# EAGLE design M8340X (EAGLE 6.6.0)
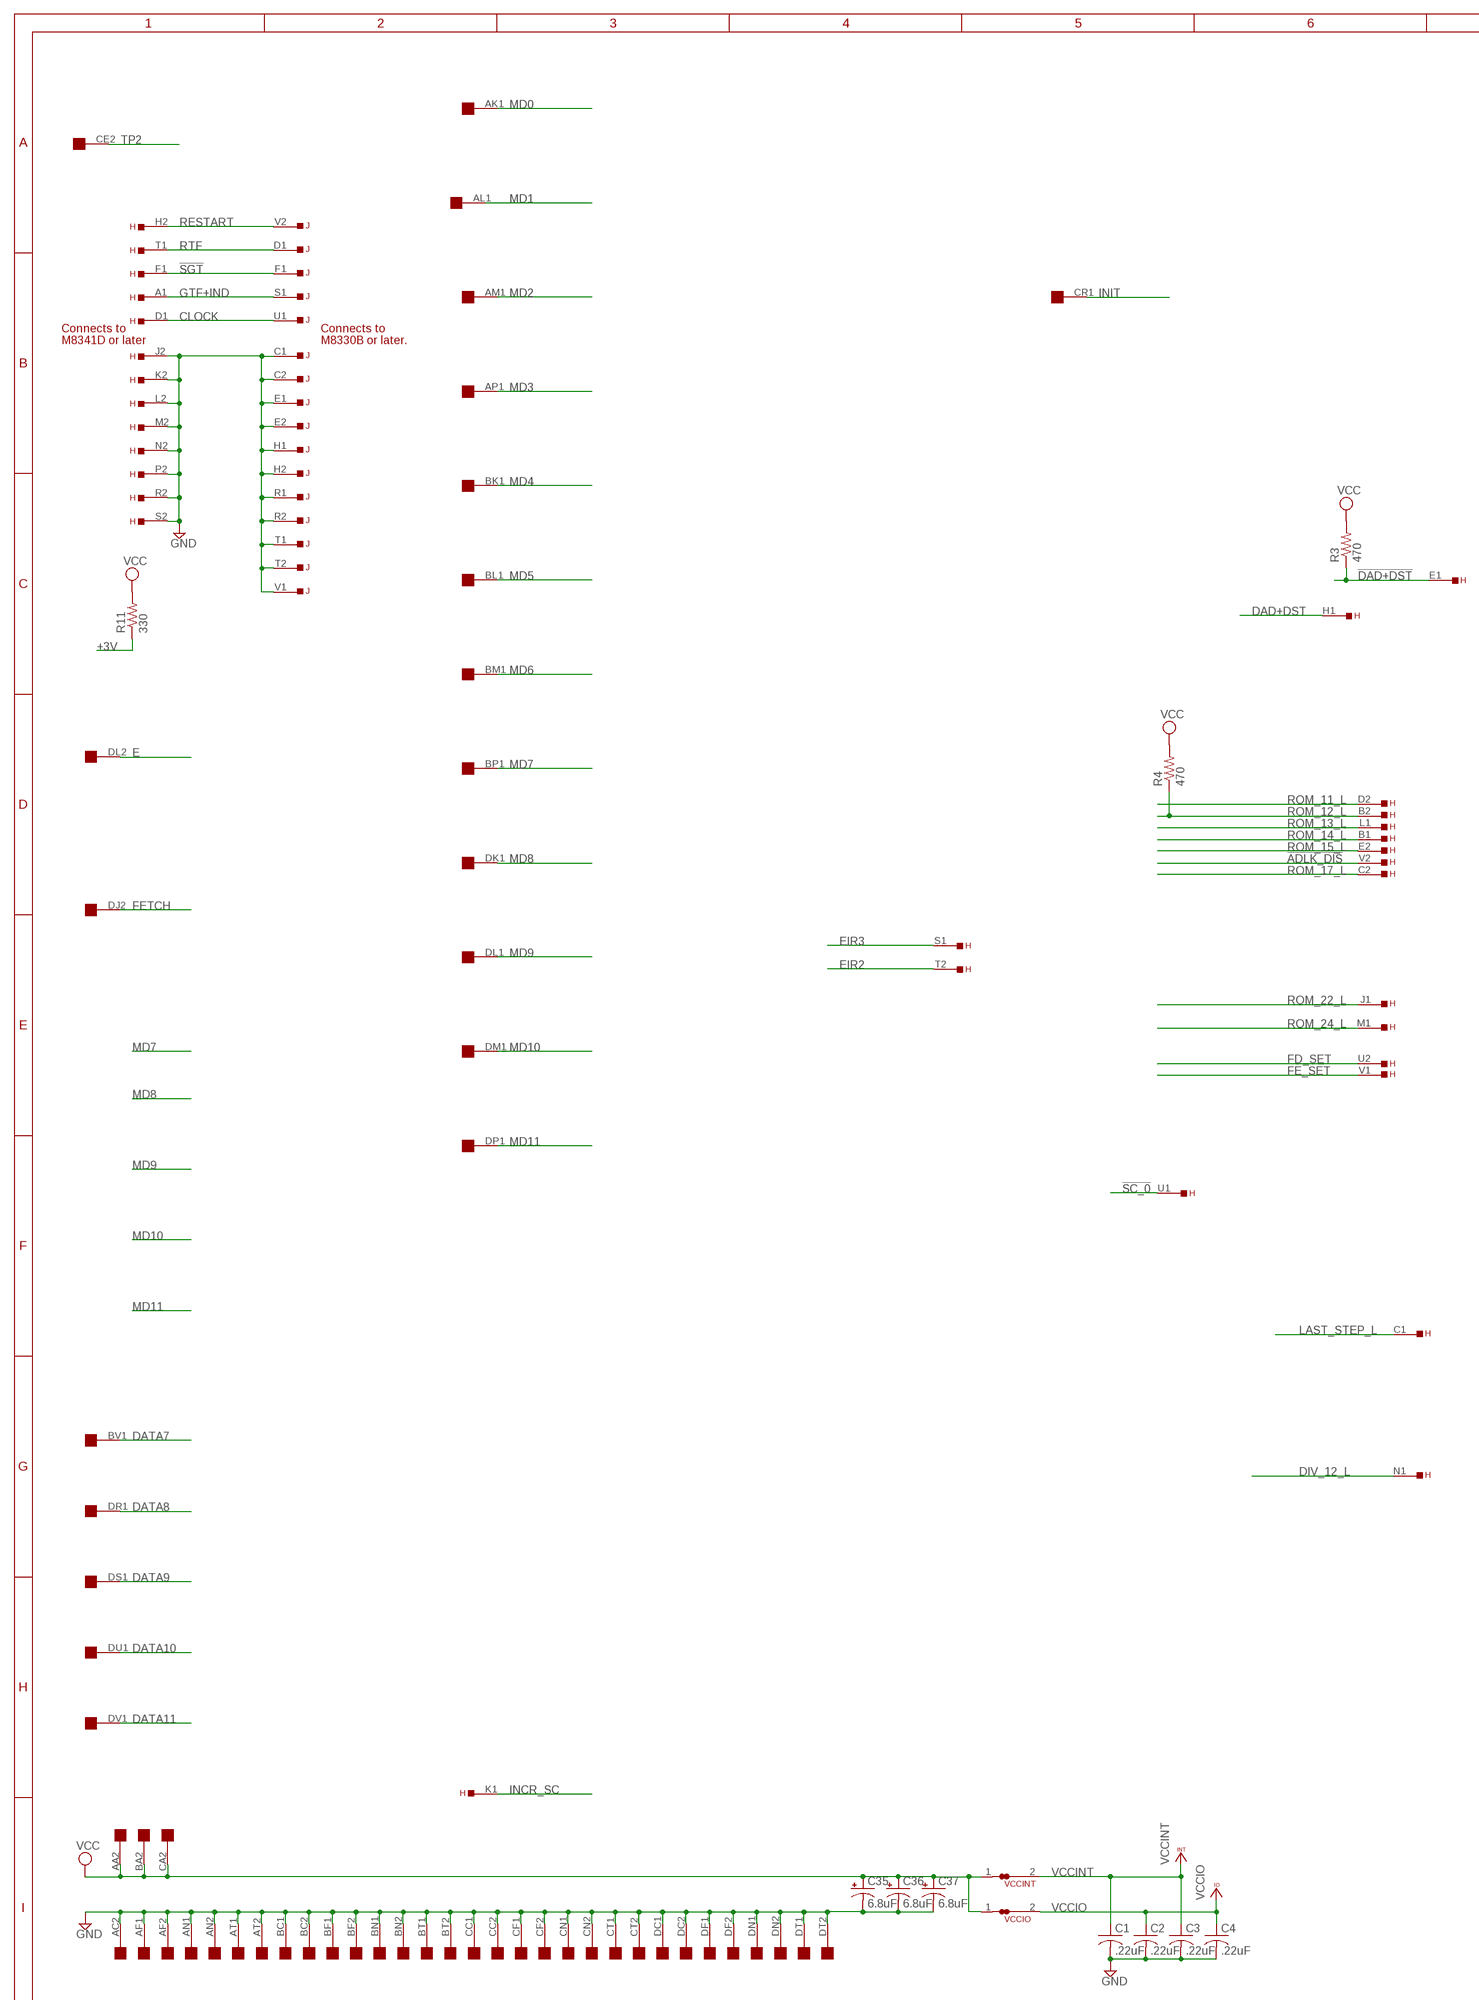
[diagram p0: schematic, sheet 1, part 1 of 2]
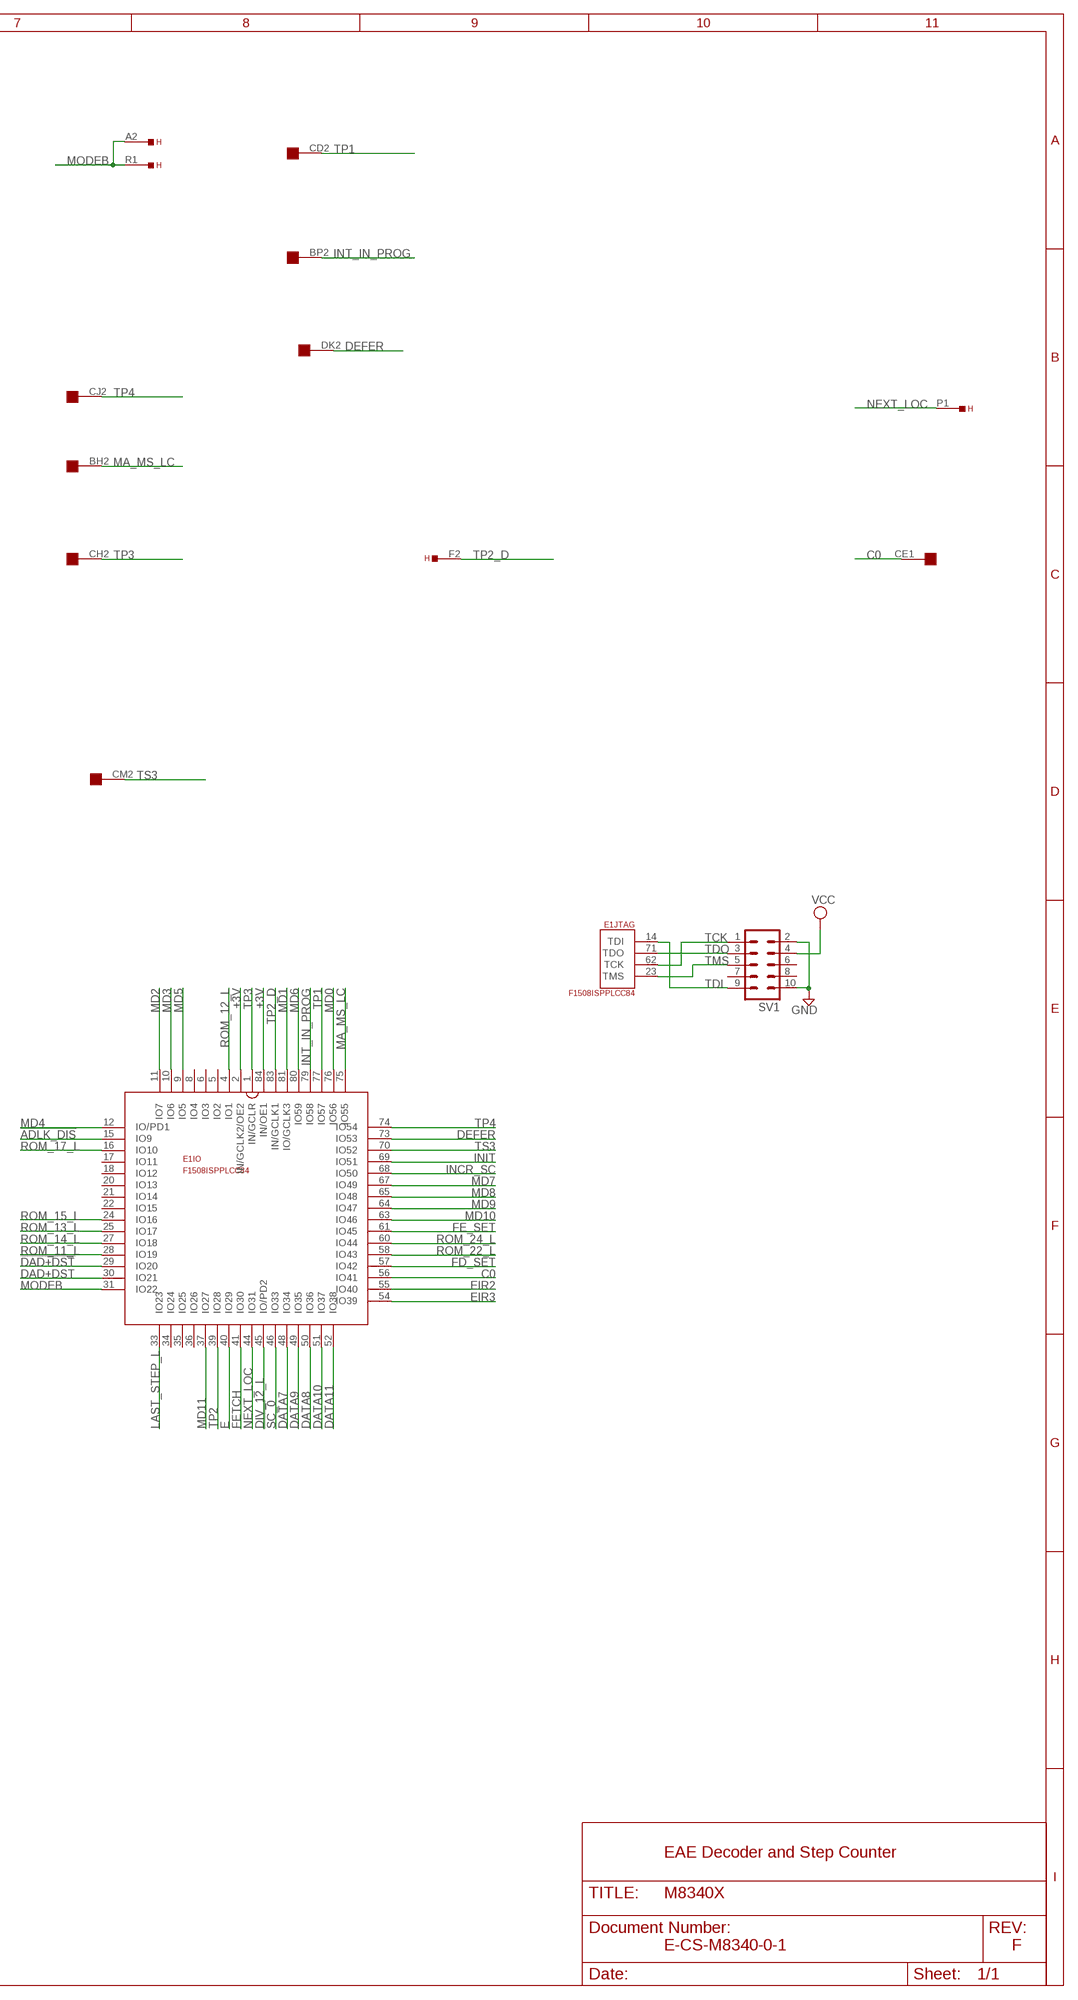
[diagram p1: schematic, sheet 1, part 2 of 2]

## Parts
C1  .22uF  C-US  [C063-025X075]
C2  .22uF  C-US  [C063-025X075]
C3  .22uF  C-US  [C063-025X075]
C4  .22uF  C-US  [C063-025X075]
C35  6.8uF  CPOL-USE20-8AXIAL  [E12-8]
C36  6.8uF  CPOL-USE20-8AXIAL  [E12-8]
C37  6.8uF  CPOL-USE20-8AXIAL  [E12-8]
E1  F1508ISPPLCC84  ATF150X84  [S84]
H  EDGE-TOP  [EDGE-CON2]
J  EDGE-TOP  [EDGE-CON2]
R3  470  R-US_0207/10  [0207/10]
R4  470  R-US_0207/10  [0207/10]
R11  330  R-US_0207/10  [0207/10]
SV1  ML10  [ML10]
U$2  QUAD  [EDGE-CON8]
VCCINT  JUMPER-NC1  [NC1]
VCCIO  JUMPER-NC1  [NC1]

## Nets
!ADLK_DIS: E1.15(IO:IO9) H.V2
!DAD+DST: E1.29(IO:IO20) H.E1 R3.1
!SC_0: E1.46(IO:IO33) H.U1
!SGT: H.F1 J.F1
+3V: E1.2(IO:IN/GCLK2/OE2) E1.84(IO:IN/OE1) R11.1
C0: E1.56(IO:IO41) U$2.CE1
CLOCK: H.D1 J.U1
DAD+DST: E1.30(IO:IO21) H.H1
DATA7: E1.48(IO:IO34) U$2.BV1
DATA8: E1.50(IO:IO36) U$2.DR1
DATA9: E1.49(IO:IO35) U$2.DS1
DATA10: E1.51(IO:IO37) U$2.DU1
DATA11: E1.52(IO:IO38) U$2.DV1
DEFER: E1.73(IO:IO53) U$2.DK2
DIV_12_L: E1.45(IO:IO/PD2) H.N1
E: E1.40(IO:IO29) U$2.DL2
EIR2: E1.55(IO:IO40) H.T2
EIR3: E1.54(IO:IO39) H.S1
FD_SET: E1.57(IO:IO42) H.U2
FE_SET: E1.61(IO:IO45) H.V1
FETCH: E1.41(IO:IO30) U$2.DJ2
GND [supply]: C1.2 C2.2 C3.2 C4.2 C35.- C36.- C37.- H.J2 H.K2 H.L2 H.M2 H.N2 H.P2 H.R2 H.S2 J.C1 J.C2 J.E1 J.E2 J.H1 J.H2 J.R1 J.R2 J.T1 J.T2 J.V1 SV1.2 SV1.10 U$2.AC2 U$2.AF1 U$2.AF2 U$2.AN1 U$2.AN2 U$2.AT1 U$2.AT2 U$2.BC1 U$2.BC2 U$2.BF1 U$2.BF2 U$2.BN1 U$2.BN2 U$2.BT1 U$2.BT2 U$2.CC1 U$2.CC2 U$2.CF1 U$2.CF2 U$2.CN1 U$2.CN2 U$2.CT1 U$2.CT2 U$2.DC1 U$2.DC2 U$2.DF1 U$2.DF2 U$2.DN1 U$2.DN2 U$2.DT1 U$2.DT2
GTF+IND: H.A1 J.S1
INCR_SC: E1.68(IO:IO50) H.K1
INIT: E1.69(IO:IO51) U$2.CR1
INT_IN_PROG: E1.79(IO:IO58) U$2.BP2
LAST_STEP_L: E1.33(IO:IO23) H.C1
MA_MS_LC: E1.75(IO:IO55) U$2.BH2
MD0: E1.76(IO:IO56) U$2.AK1
MD1: E1.81(IO:IO/GCLK3) U$2.AL1
MD2: E1.11(IO:IO7) U$2.AM1
MD3: E1.10(IO:IO6) U$2.AP1
MD4: E1.12(IO:IO/PD1) U$2.BK1
MD5: E1.9(IO:IO5) U$2.BL1
MD6: E1.80(IO:IO59) U$2.BM1
MD7: E1.67(IO:IO49) U$2.BP1
MD8: E1.65(IO:IO48) U$2.DK1
MD9: E1.64(IO:IO47) U$2.DL1
MD10: E1.63(IO:IO46) U$2.DM1
MD11: E1.37(IO:IO27) U$2.DP1
MODEB: E1.31(IO:IO22) H.A2 H.R1
NEXT_LOC: E1.44(IO:IO31) H.P1
RESTART: H.H2 J.V2
ROM_11_L: E1.28(IO:IO19) H.D2
ROM_12_L: E1.4(IO:IO1) H.B2 R4.1
ROM_13_L: E1.25(IO:IO17) H.L1
ROM_14_L: E1.27(IO:IO18) H.B1
ROM_15_L: E1.24(IO:IO16) H.E2
ROM_17_L: E1.16(IO:IO10) H.C2
ROM_22_L: E1.58(IO:IO43) H.J1
ROM_24_L: E1.60(IO:IO44) H.M1
RTF: H.T1 J.D1
TCK: E1.62(JTAG:TCK) SV1.1
TDI: E1.14(JTAG:TDI) SV1.9
TDO: E1.71(JTAG:TDO) SV1.3
TMS: E1.23(JTAG:TMS) SV1.5
TP1: E1.77(IO:IO57) U$2.CD2
TP2: E1.39(IO:IO28) U$2.CE2
TP2_D: E1.83(IO:IN/GCLK1) H.F2
TP3: E1.1(IO:IN/GCLR) U$2.CH2
TP4: E1.74(IO:IO54) U$2.CJ2
TS3: E1.70(IO:IO52) U$2.CM2
VCC [supply]: C35.+ C36.+ C37.+ R3.2 R4.2 R11.2 SV1.4 U$2.AA2 U$2.BA2 U$2.CA2 VCCINT.1 VCCIO.1
VCCINT: C1.1 C3.1 VCCINT.2
VCCIO: C2.1 C4.1 VCCIO.2
Unconnected: E1.5(IO:IO2) E1.6(IO:IO3) E1.8(IO:IO4) E1.17(IO:IO11) E1.18(IO:IO12) E1.20(IO:IO13) E1.21(IO:IO14) E1.22(IO:IO15) E1.34(IO:IO24) E1.35(IO:IO25) E1.36(IO:IO26) J.A1 J.A2 J.B1 J.B2 J.D2 J.F2 J.J1 J.J2 J.K1 J.K2 J.L1 J.L2 J.M1 J.M2 J.N1 J.N2 J.P1 J.P2 J.S2 J.U2 SV1.6 SV1.7 SV1.8 U$2.AA1 U$2.AB1 U$2.AB2 U$2.AC1 U$2.AD1 U$2.AD2 U$2.AE1 U$2.AE2 U$2.AH1 U$2.AH2 U$2.AJ1 U$2.AJ2 U$2.AK2 U$2.AL2 U$2.AM2 U$2.AP2 U$2.AR1 U$2.AR2 U$2.AS1 U$2.AS2 U$2.AU1 U$2.AU2 U$2.AV1 U$2.AV2 U$2.BA1 U$2.BB1 U$2.BB2 U$2.BD1 U$2.BD2 U$2.BE1 U$2.BE2 U$2.BH1 U$2.BJ1 U$2.BJ2 U$2.BK2 U$2.BL2 U$2.BM2 U$2.BR1 U$2.BR2 U$2.BS1 U$2.BS2 U$2.BU1 U$2.BU2 U$2.BV2 U$2.CA1 U$2.CB1 U$2.CB2 U$2.CD1 U$2.CH1 U$2.CJ1 U$2.CK1 U$2.CK2 U$2.CL1 U$2.CL2 U$2.CM1 U$2.CP1 U$2.CP2 U$2.CR2 U$2.CS1 U$2.CS2 U$2.CU1 U$2.CU2 U$2.CV1 U$2.CV2 U$2.DA1 U$2.DA2 U$2.DB1 U$2.DB2 U$2.DD1 U$2.DD2 U$2.DE1 U$2.DE2 U$2.DH1 U$2.DH2 U$2.DJ1 U$2.DM2 U$2.DP2 U$2.DR2 U$2.DS2 U$2.DU2 U$2.DV2

## Notes on the sheet
- Connects to | Connects to
- M8341D or later | M8330B or later.
- EAE Decoder and Step Counter
- E-CS-M8340-0-1 | F

## Power pins joined to a net without a drawn wire
GND: E1.7(GND) E1.19(GND) E1.32(GND) E1.42(GND) E1.47(GND) E1.59(GND) E1.72(GND) E1.82(GND)
VCCINT: E1.3(VCCINT) E1.43(VCCINT)
VCCIO: E1.13(VCCIO) E1.26(VCCIO) E1.38(VCCIO) E1.53(VCCIO) E1.66(VCCIO) E1.78(VCCIO)

## Library data of the parts
C1-C4 = dec-con:C-US: Capacitors with funky DEC lead spacing.
C35-C37 = dec-con:CPOL-USE20-8AXIAL: A 0.8 inch electrolytic.
E1 = atmel-cpld:ATF150X84: ATF150x in 84 pin package.
H J = dec-con:EDGE-TOP: Labeled DEC edge connector, suitable for top connector.
R3 R4 R11 = rcl:R-US_: RESISTOR, American symbol
SV1 = con-harting-ml:ML10: HARTING; OC_FARNELL: unknown; OC_NEWARK: unknown
U$2 = dec-con:QUAD: Quad-Height DEC board
VCCINT VCCIO = dec-con:JUMPER: Normally closed SMD Jumper (Generates a DRC error.)

## Net classes
0 default: width 0.61 mm
1 supply: width 0.61 mm

## Board
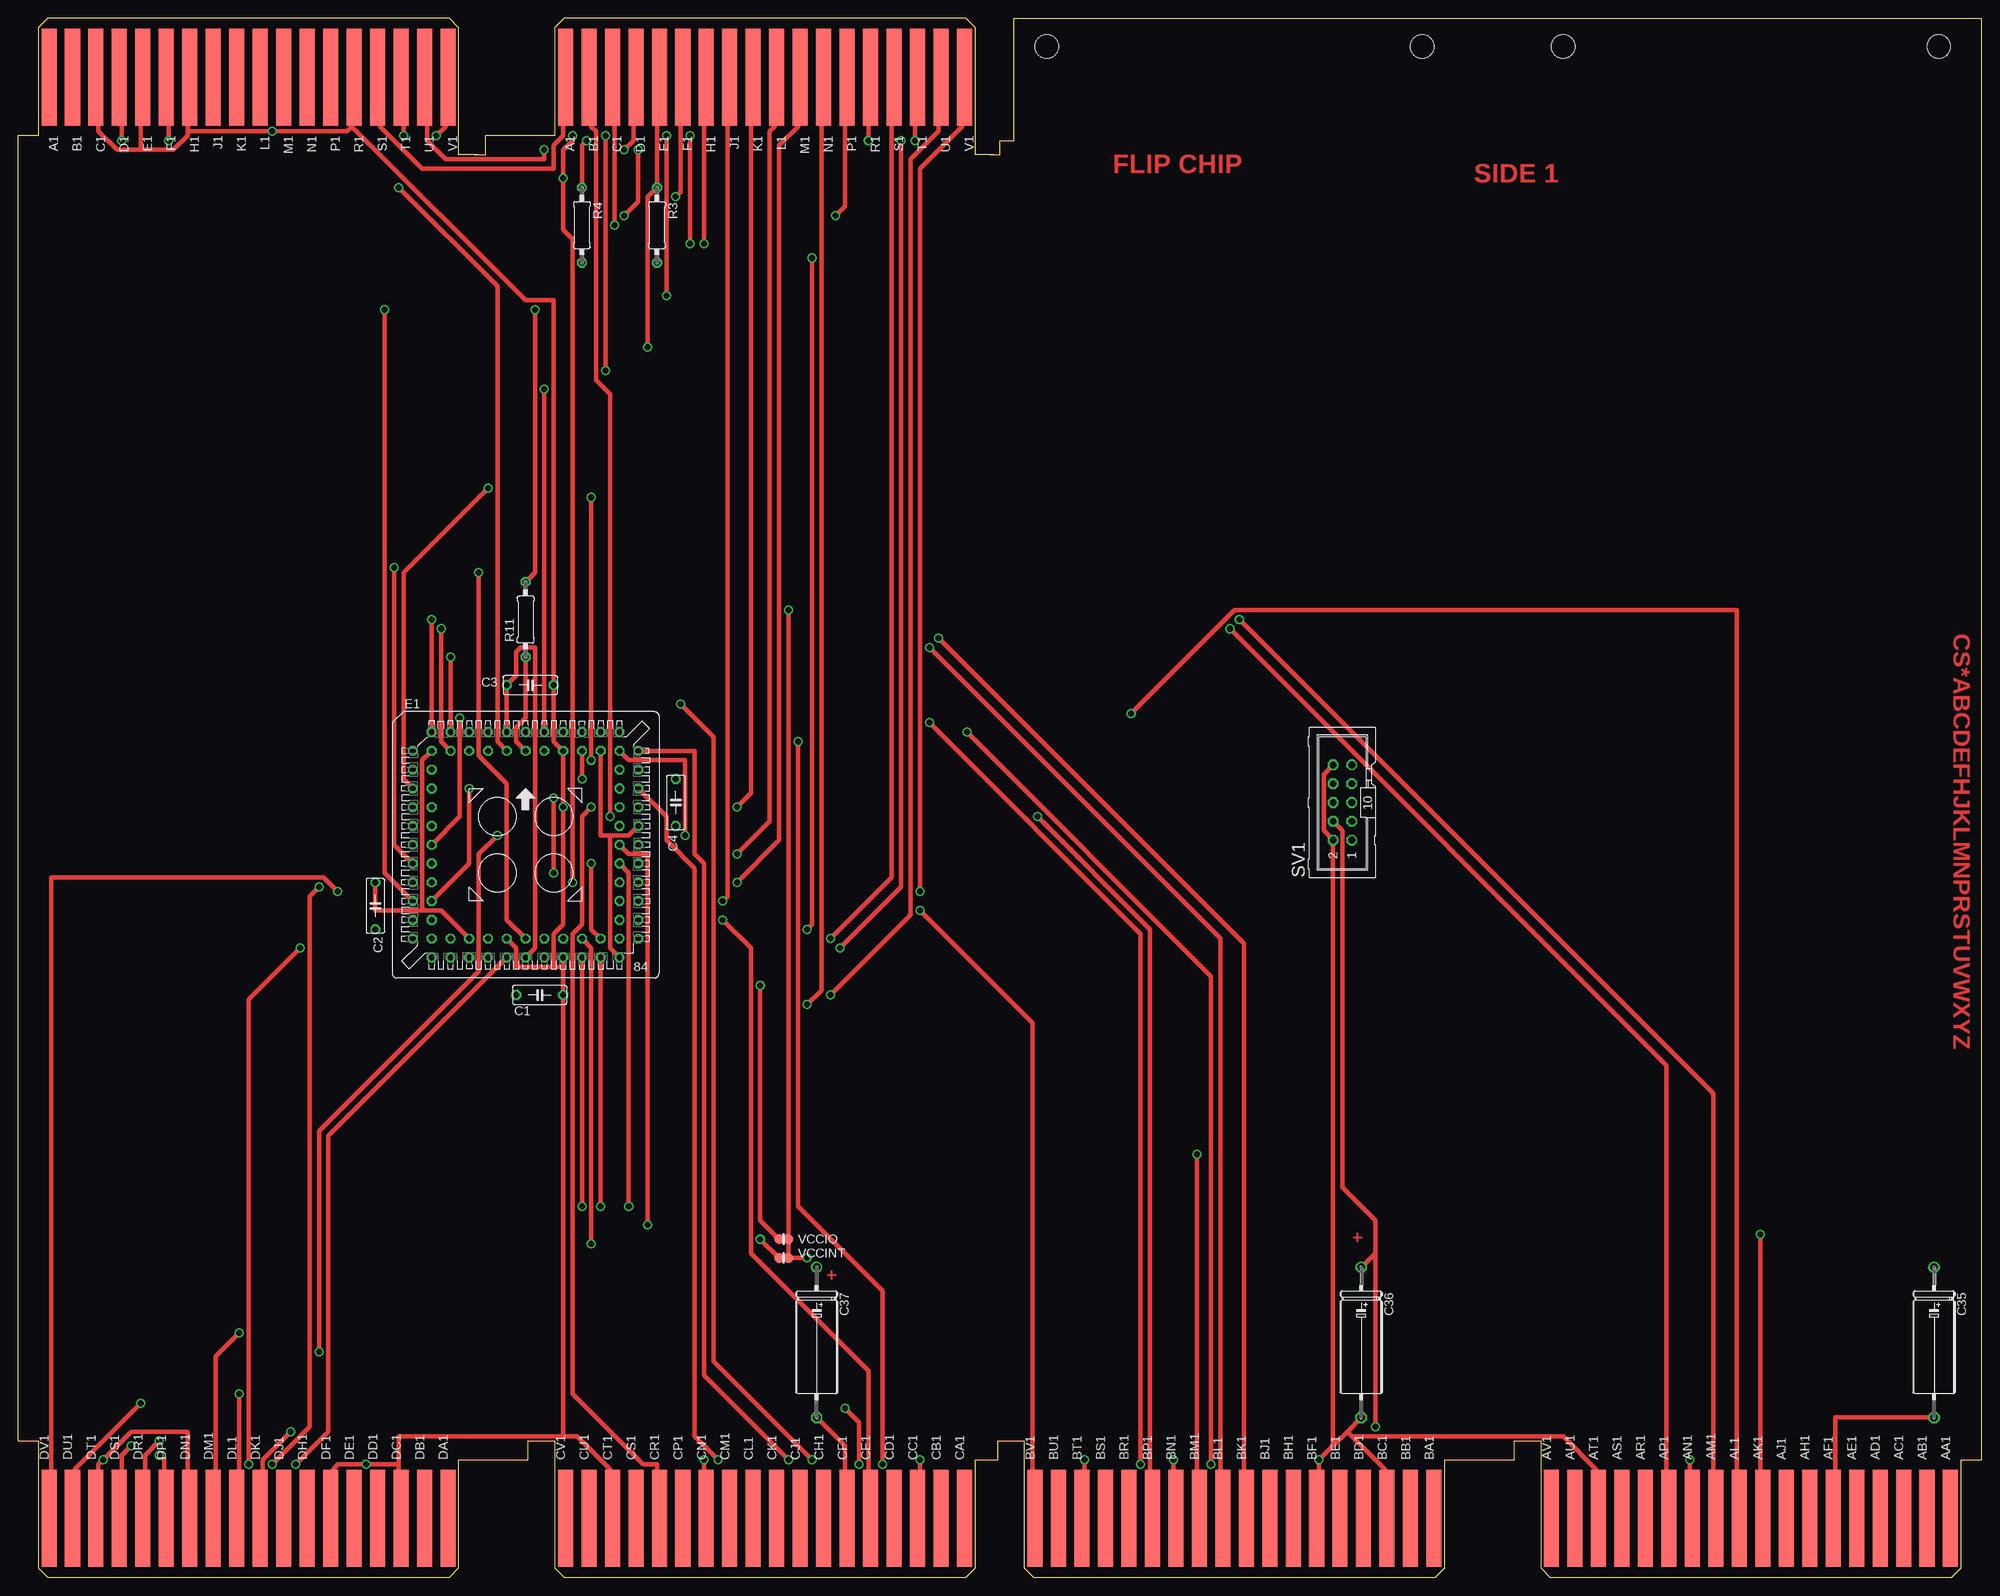
[diagram p2: board, top side]
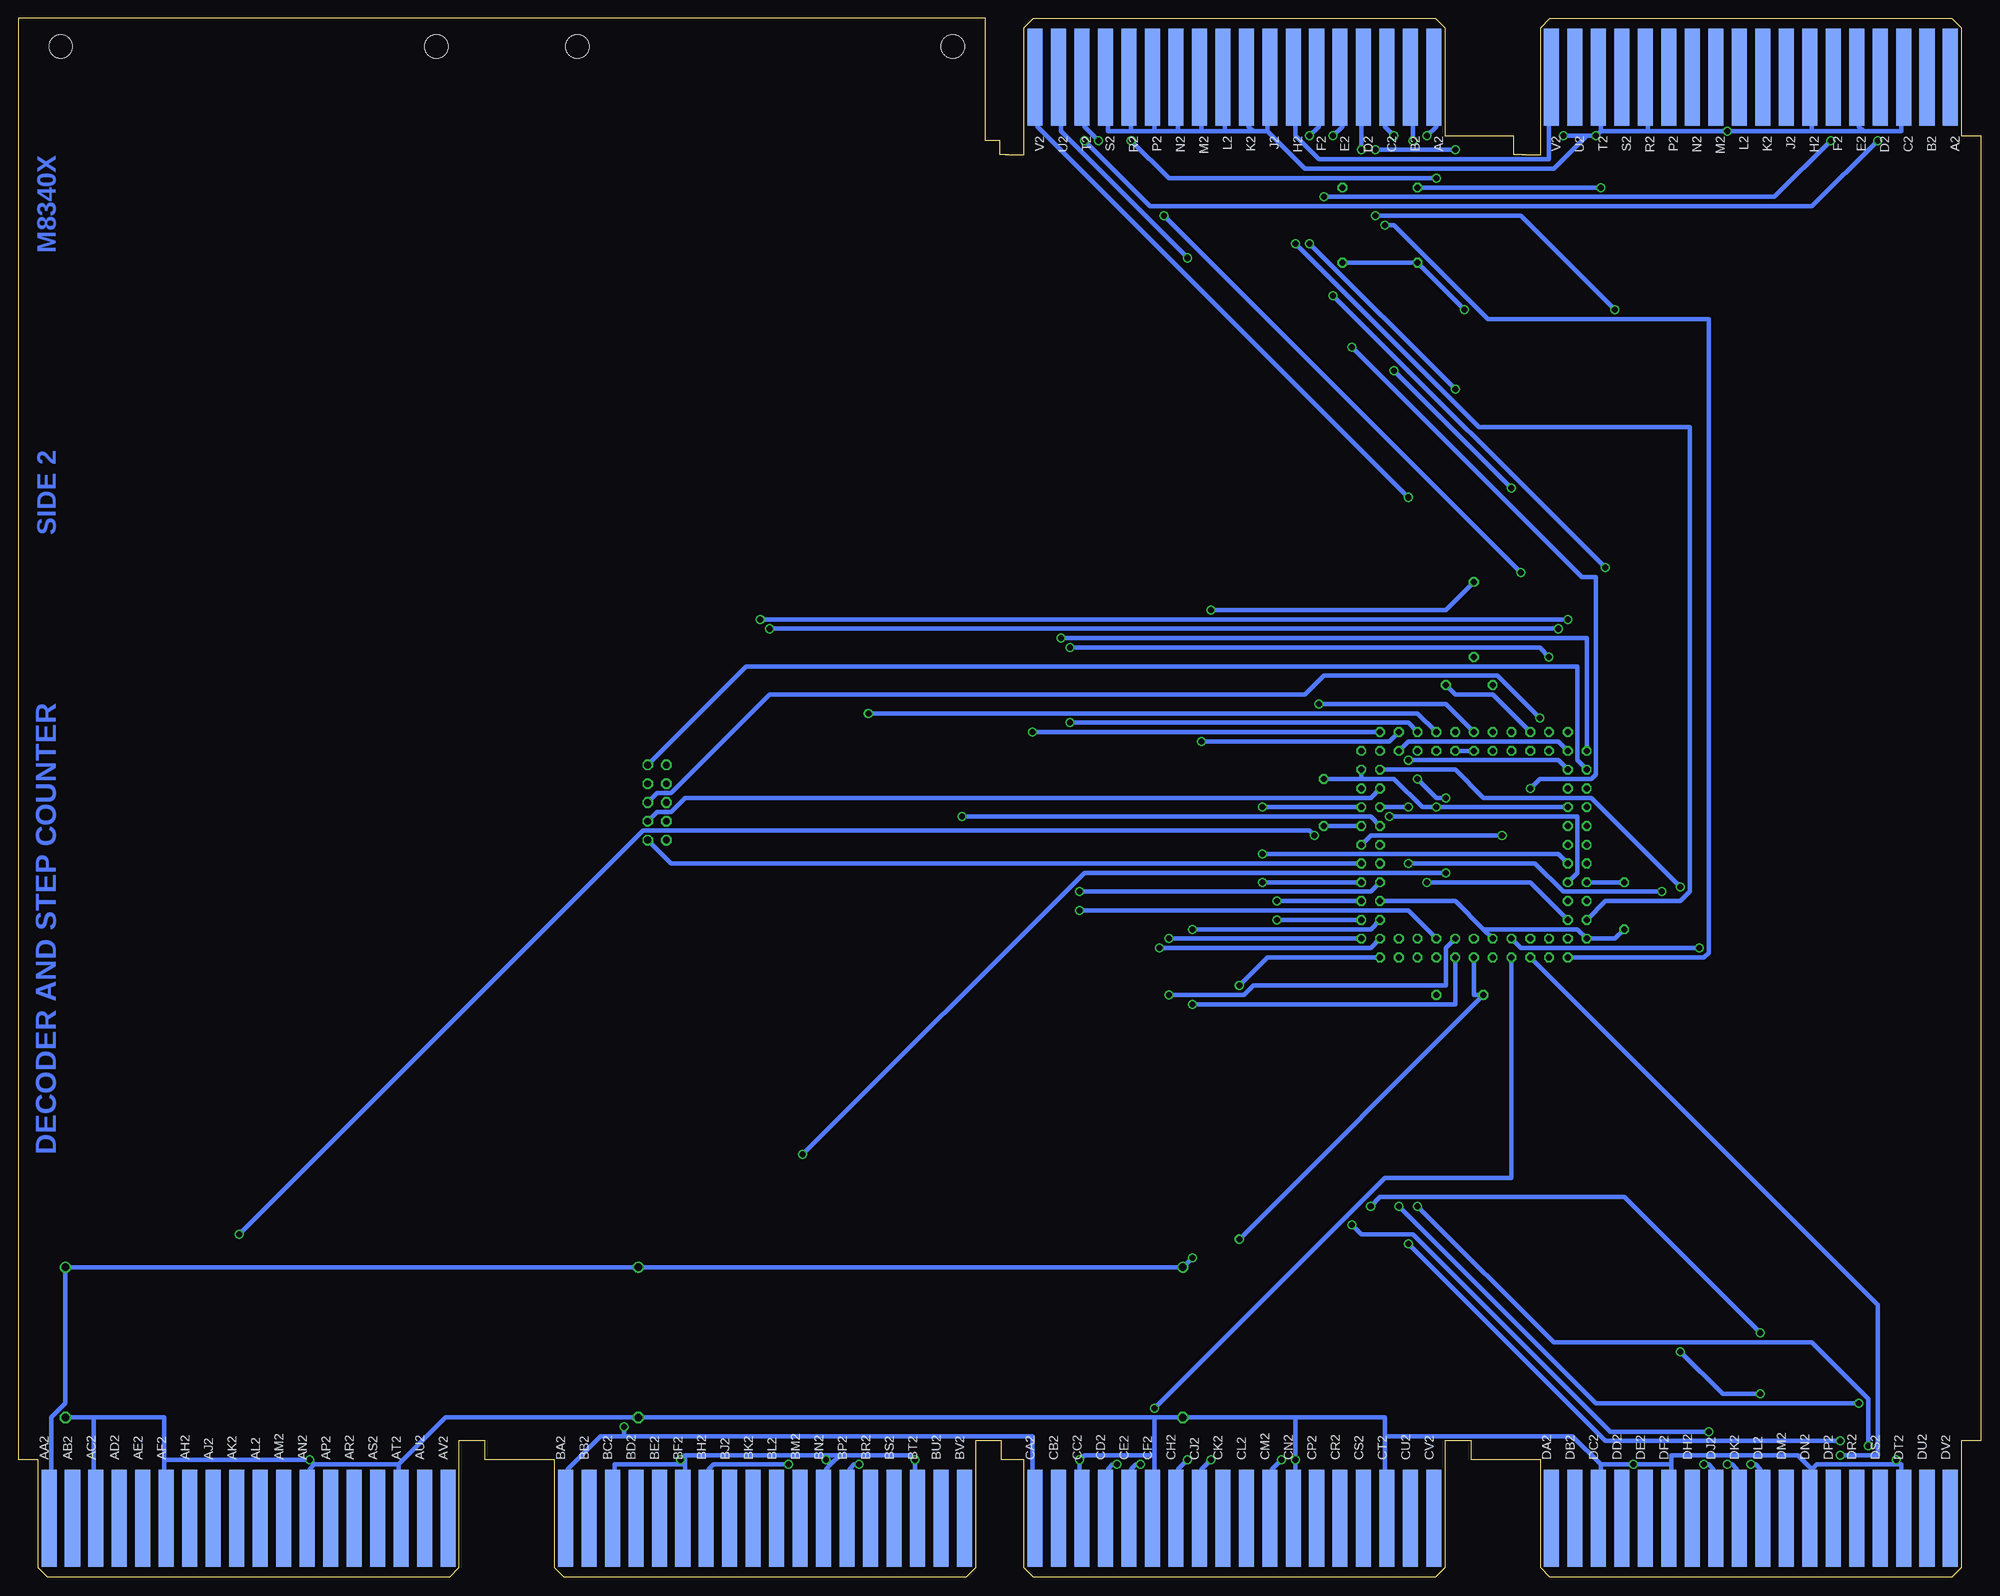
[diagram p3: board, bottom side, seen from below]

Size 265.43 x 210.82 mm. Coordinates in mm from the lower left corner, seen from the top.
Outline: 61.59,192.41 63.18,192.41 63.18,194.94 69.85,194.94
Outline: 131.44,192.41 132.72,192.41 132.72,194.31 134.62,194.31 134.62,210.82 265.43,210.82 265.43,15.88
Outline: 0,194.94 0,18.41 0.64,18.41
Copper layers (1+16): Top 0.035mm / dielectric 1.5mm / Bottom 0.035mm
Design rules "16mils": minimum track width 16mil, minimum drill 32mil, track to track 15mil, track to pad 10mil, pad to pad 10mil, via to via 10mil, smd to smd 10mil, copper to edge 13mil, drill to drill 10mil, minimum pad ring 10mil, minimum via ring 8mil, stop-mask expansion 0mil, vias tented up to drill 0mil, thermal gap 10mil
Holes 3.2 mm at 139.06,207.01 189.87,207.01 208.91,207.01 259.71,207.01

### Footprints (pad centres in the part's own frame; a part is rotated, then mirrored left to right if it is on the bottom)
C063-025X075 = drill 0.813 octagon: 1 -2.54,0; 2 3.81,0
E12-8 = drill 1.016: + -10.16,0 | drill 1.016 octagon: - 10.16,0
S84 = drill 0.813: 1 0,15.24 | drill 0.813 octagon: 2 0,12.7; 3 -2.54,15.24; 4 -2.54,12.7; 5 -5.08,15.24; 6 -5.08,12.7; 7 -7.62,15.24; 8 -7.62,12.7; 9 -10.16,15.24; 10 -10.16,12.7; 11 -12.7,15.24; 12 -15.24,12.7; 13 -12.7,12.7; 14 -15.24,10.16; 15 -12.7,10.16; 16 -15.24,7.62; 17 -12.7,7.62; 18 -15.24,5.08; 19 -12.7,5.08; 20 -15.24,2.54; 21 -12.7,2.54; 22 -15.24,0; 23 -12.7,0; 24 -15.24,-2.54; 25 -12.7,-2.54; 26 -15.24,-5.08; 27 -12.7,-5.08; 28 -15.24,-7.62; 29 -12.7,-7.62; 30 -15.24,-10.16; 31 -12.7,-10.16; 32 -15.24,-12.7; 33 -12.7,-15.24; 34 -12.7,-12.7; 35 -10.16,-15.24; 36 -10.16,-12.7; 37 -7.62,-15.24; 38 -7.62,-12.7; 39 -5.08,-15.24; 40 -5.08,-12.7; 41 -2.54,-15.24; 42 -2.54,-12.7; 43 0,-15.24; 44 0,-12.7; 45 2.54,-15.24; 46 2.54,-12.7; 47 5.08,-15.24; 48 5.08,-12.7; 49 7.62,-15.24; 50 7.62,-12.7; 51 10.16,-15.24; 52 10.16,-12.7; 53 12.7,-15.24; 54 15.24,-12.7; 55 12.7,-12.7; 56 15.24,-10.16; 57 12.7,-10.16; 58 15.24,-7.62; 59 12.7,-7.62; 60 15.24,-5.08; 61 12.7,-5.08; 62 15.24,-2.54; 63 12.7,-2.54; 64 15.24,0; 65 12.7,0; 66 15.24,2.54; 67 12.7,2.54; 68 15.24,5.08; 69 12.7,5.08; 70 15.24,7.62; 71 12.7,7.62; 72 15.24,10.16; 73 12.7,10.16; 74 15.24,12.7; 75 12.7,15.24; 76 12.7,12.7; 77 10.16,15.24; 78 10.16,12.7; 79 7.62,15.24; 80 7.62,12.7; 81 5.08,15.24; 82 5.08,12.7; 83 2.54,15.24; 84 2.54,12.7
EDGE-CON2 = smd 13.106 x 2.032: A1 7.938,4.128; B1 7.938,7.303; C1 7.938,10.477; D1 7.938,13.652; E1 7.938,16.828; F1 7.938,20.003; H1 7.938,23.177; J1 7.938,26.352; K1 7.938,29.527; L1 7.938,32.703; M1 7.938,35.877; N1 7.938,39.053; P1 7.938,42.227; R1 7.938,45.403; S1 7.938,48.578; T1 7.938,51.752; U1 7.938,54.928; V1 7.938,58.102 | smd 13.106 x 2.032 bottom: A2 7.938,4.128; B2 7.938,7.303; C2 7.938,10.477; D2 7.938,13.652; E2 7.938,16.828; F2 7.938,20.003; H2 7.938,23.177; J2 7.938,26.352; K2 7.938,29.527; L2 7.938,32.703; M2 7.938,35.877; N2 7.938,39.053; P2 7.938,42.227; R2 7.938,45.403; S2 7.938,48.578; T2 7.938,51.752; U2 7.938,54.928; V2 7.938,58.102
0207/10 = drill 0.813 octagon: 1 -5.08,0; 2 5.08,0
ML10 = drill 0.914 octagon: 1 -5.08,-1.27; 2 -5.08,1.27; 3 -2.54,-1.27; 4 -2.54,1.27; 5 0,-1.27; 6 0,1.27; 7 2.54,-1.27; 8 2.54,1.27; 9 5.08,-1.27; 10 5.08,1.27
EDGE-CON8 = smd 2.032 x 13.106: AA1 261.303,7.938; AB1 258.127,7.938; AC1 254.952,7.938; AD1 251.778,7.938; AE1 248.602,7.938; AF1 245.428,7.938; AH1 242.252,7.938; AJ1 239.077,7.938; AK1 235.903,7.938; AL1 232.727,7.938; AM1 229.553,7.938; AN1 226.377,7.938; AP1 223.202,7.938; AR1 220.028,7.938; AS1 216.852,7.938; AT1 213.678,7.938; AU1 210.502,7.938; AV1 207.327,7.938; BA1 191.452,7.938; BB1 188.278,7.938; BC1 185.102,7.938; BD1 181.928,7.938; BE1 178.752,7.938; BF1 175.577,7.938; BH1 172.403,7.938; BJ1 169.227,7.938; BK1 166.053,7.938; BL1 162.877,7.938; BM1 159.702,7.938; BN1 156.528,7.938; BP1 153.352,7.938; BR1 150.178,7.938; BS1 147.002,7.938; BT1 143.827,7.938; BU1 140.653,7.938; BV1 137.477,7.938; CA1 127.953,7.938; CB1 124.778,7.938; CC1 121.603,7.938; CD1 118.427,7.938; CE1 115.252,7.938; CF1 112.078,7.938; CH1 108.903,7.938; CJ1 105.728,7.938; CK1 102.552,7.938; CL1 99.377,7.938; CM1 96.203,7.938; CN1 93.028,7.938; CP1 89.853,7.938; CR1 86.677,7.938; CS1 83.502,7.938; CT1 80.328,7.938; CU1 77.153,7.938; CV1 73.978,7.938; DA1 58.102,7.938; DB1 54.928,7.938; DC1 51.752,7.938; DD1 48.578,7.938; DE1 45.403,7.938; DF1 42.227,7.938; DH1 39.053,7.938; DJ1 35.877,7.938; DK1 32.703,7.938; DL1 29.527,7.938; DM1 26.352,7.938; DN1 23.177,7.938; DP1 20.003,7.938; DR1 16.828,7.938; DS1 13.652,7.938; DT1 10.477,7.938; DU1 7.303,7.938; DV1 4.128,7.938 | smd 2.032 x 13.106 bottom: AA2 261.303,7.938; AB2 258.127,7.938; AC2 254.952,7.938; AD2 251.778,7.938; AE2 248.602,7.938; AF2 245.428,7.938; AH2 242.252,7.938; AJ2 239.077,7.938; AK2 235.903,7.938; AL2 232.727,7.938; AM2 229.553,7.938; AN2 226.377,7.938; AP2 223.202,7.938; AR2 220.028,7.938; AS2 216.852,7.938; AT2 213.678,7.938; AU2 210.502,7.938; AV2 207.327,7.938; BA2 191.452,7.938; BB2 188.278,7.938; BC2 185.102,7.938; BD2 181.928,7.938; BE2 178.752,7.938; BF2 175.577,7.938; BH2 172.403,7.938; BJ2 169.227,7.938; BK2 166.053,7.938; BL2 162.877,7.938; BM2 159.702,7.938; BN2 156.528,7.938; BP2 153.352,7.938; BR2 150.178,7.938; BS2 147.002,7.938; BT2 143.827,7.938; BU2 140.653,7.938; BV2 137.477,7.938; CA2 127.953,7.938; CB2 124.778,7.938; CC2 121.603,7.938; CD2 118.427,7.938; CE2 115.252,7.938; CF2 112.078,7.938; CH2 108.903,7.938; CJ2 105.728,7.938; CK2 102.552,7.938; CL2 99.377,7.938; CM2 96.203,7.938; CN2 93.028,7.938; CP2 89.853,7.938; CR2 86.677,7.938; CS2 83.502,7.938; CT2 80.328,7.938; CU2 77.153,7.938; CV2 73.978,7.938; DA2 58.102,7.938; DB2 54.928,7.938; DC2 51.752,7.938; DD2 48.578,7.938; DE2 45.403,7.938; DF2 42.227,7.938; DH2 39.053,7.938; DJ2 35.877,7.938; DK2 32.703,7.938; DL2 29.527,7.938; DM2 26.352,7.938; DN2 23.177,7.938; DP2 20.003,7.938; DR2 16.828,7.938; DS2 13.652,7.938; DT2 10.477,7.938; DU2 7.303,7.938; DV2 4.128,7.938
NC1 = smd 1.346 x 1.346: 1 -0.635,0; 2 0.635,0

### Placement (x,y rotation side)
C1  69.85,78.74 0 top
C2  48.26,91.44 270 top
C3  68.58,120.65 0 top
C4  88.9,104.14 90 top
C35  259.08,31.75 270 top
C36  181.61,31.75 270 top
C37  107.95,31.75 270 top
E1  68.58,99.06 0 top
H  69.85,210.82 270 top
J  0,210.82 270 top
R3  86.36,182.88 270 top
R4  76.2,182.88 270 top
R11  68.58,129.54 90 top
SV1  179.07,104.78 90 top
U$2  0,0 0 top
VCCINT  103.5,43.18 180 top
VCCIO  103.5,45.72 180 top

### Tracks (layer width: path | path; a pad name or v marks a point on that pad's centre or on a via)
!ADLK_DIS  (via drill 0.81)
  Top 0.61: v77.47,146.05 v77.47,110.49
  Bottom 0.61: E1.15 57.15,110.49 v77.47,110.49 | v77.47,146.05 127.64,196.22 127.64,202.56 H.V2
!DAD+DST  (via drill 0.81)
  Top 0.61: E1.29 60.96,96.52 v60.96,106.68 | v85.09,166.37 85.09,186.69 R3.1 86.36,202.56 H.E1
  Bottom 0.61: v60.96,106.68 59.69,107.95 52.7,107.95 52.07,108.58 52.07,135.25 53.98,135.25 v85.09,166.37
!SC_0  (via drill 0.81)
  Top 0.61: v109.86,78.74 120.65,89.53 120.65,191.77 124.46,195.58 124.46,202.56 H.U1
  Bottom 0.61: E1.46 72.39,85.09 72.39,80.01 98.42,80.01 99.69,78.74 v109.86,78.74
!SGT  (via drill 0.81)
  Top 0.61: v20.32,194.31 20.32,202.56 J.F1 | v88.9,186.69 89.53,187.32 89.53,202.56 H.F1
  Bottom 0.61: v20.32,194.31 27.94,186.69 v88.9,186.69
+3V
  Top 0.61: R11.1 68.58,116.2 67.31,114.94 67.31,113.03 E1.2
  Bottom 0.61: E1.84 E1.2
C0  (via drill 0.81)
  Top 0.61: v95.25,88.9 99.06,85.09 99.06,43.81 114.94,27.94 114.94,8.26 U$2.CE1
  Bottom 0.61: v95.25,88.9 E1.56
CLOCK  (via drill 0.81)
  Top 0.61: v71.12,193.04 71.12,191.77 57.78,191.77 55.24,194.31 55.24,202.56 J.U1 | v81.92,193.04 83.19,194.31 83.19,202.56 H.D1
  Bottom 0.61: v81.92,193.04 v71.12,193.04
DAD+DST  (via drill 0.81)
  Top 0.61: v92.71,180.34 92.71,202.56 H.H1
  Bottom 0.61: E1.30 50.8,91.44 40.64,91.44 39.37,92.71 39.37,155.57 67.94,155.57 v92.71,180.34
DATA7  (via drill 0.81)
  Top 0.61: v121.92,90.17 137.16,74.93 137.16,8.26 U$2.BV1
  Bottom 0.61: E1.48 77.47,90.17 v121.92,90.17
DATA8  (via drill 0.81)
  Top 0.61: E1.50 77.47,85.09 v77.47,45.09 | v19.05,18.41 17.14,16.51 17.14,8.26 U$2.DR1
  Bottom 0.61: v77.47,45.09 50.8,18.41 v19.05,18.41
DATA9  (via drill 0.81)
  Top 0.61: v76.2,50.16 E1.49 | v15.24,17.78 13.97,16.51 13.97,8.26 U$2.DS1
  Bottom 0.61: v76.2,50.16 57.78,31.75 22.86,31.75 15.24,24.13 v15.24,17.78
DATA10  (via drill 0.81)
  Top 0.61: v78.74,50.16 E1.51 | v16.51,23.5 7.62,14.61 7.62,8.26 U$2.DU1
  Bottom 0.61: v78.74,50.16 52.07,23.5 v16.51,23.5
DATA11  (via drill 0.81)
  Top 0.61: E1.52 77.47,87.63 v77.47,96.52 | v43.18,92.71 41.27,94.61 4.45,94.61 4.45,8.26 U$2.DV1
  Bottom 0.61: v77.47,96.52 60.33,96.52 56.52,92.71 v43.18,92.71
DEFER  (via drill 0.81)
  Top 0.61: v40.64,93.34 39.37,92.08 39.37,20.32 v34.29,15.24
  Bottom 0.61: E1.73 71.12,109.22 67.31,105.41 52.7,105.41 v40.64,93.34 | v34.29,15.24 33.66,15.24 33.02,14.61 33.02,8.26 U$2.DK2
DIV_12_L  (via drill 0.81)
  Top 0.61: v106.68,77.47 108.58,79.38 108.58,202.56 H.N1
  Bottom 0.61: E1.45 71.12,77.47 v106.68,77.47
E  (via drill 0.81)
  Top 0.61: v38.1,85.09 31.11,78.11 v31.11,15.24
  Bottom 0.61: E1.40 62.23,85.09 v38.1,85.09 | v31.11,15.24 30.48,15.24 29.84,14.61 29.84,8.26 U$2.DL2
EIR2  (via drill 0.81)
  Top 0.61: v111.12,85.09 119.38,93.34 v119.38,194.31
  Bottom 0.61: E1.55 82.55,85.09 v111.12,85.09 | v119.38,194.31 121.28,196.22 121.28,202.56 H.T2
EIR3  (via drill 0.81)
  Top 0.61: v109.86,86.36 118.11,94.61 118.11,202.56 H.S1
  Bottom 0.61: v109.86,86.36 E1.54
FD_SET  (via drill 0.81)
  Top 0.61: v106.68,87.63 107.31,88.27 v107.31,178.44
  Bottom 0.61: E1.57 82.55,87.63 v106.68,87.63 | v107.31,178.44 124.46,195.58 124.46,202.56 H.U2
FE_SET  (via drill 0.81)
  Top 0.61: v121.92,92.71 121.92,190.5 127.64,196.22 127.64,202.56 H.V1
  Bottom 0.61: E1.61 82.55,92.71 v121.92,92.71
FETCH  (via drill 0.81)
  Top 0.61: E1.41 41.91,59.69 41.91,19.68 v37.47,15.24
  Bottom 0.61: v37.47,15.24 36.83,15.24 36.2,14.61 36.2,8.26 U$2.DJ2
GND  (via drill 0.81)
  Top 0.61: v226.06,15.88 226.06,8.26 U$2.AN1 | C35.- 245.75,21.59 245.75,8.26 U$2.AF1 | v144.15,15.88 144.15,8.26 U$2.BT2 | v156.21,15.88 156.21,8.26 U$2.BN2 | SV1.10 176.53,108.58 176.53,100.97 SV1.2 177.8,17.78 | 177.8,17.78 v175.9,15.88 175.9,8.26 U$2.BF2 | 177.8,17.78 179.71,19.68 | 179.71,19.68 C36.- | 179.71,19.68 180.34,19.05 | 180.34,19.05 184.78,14.61 184.78,8.26 U$2.BC2 | 180.34,19.05 208.91,19.05 213.36,14.61 213.36,8.26 U$2.AT1 | 16.51,193.04 13.34,193.04 10.79,195.58 10.79,202.56 J.C2 | 16.51,193.04 16.51,202.56 J.E1 | 22.86,195.58 22.86,194.94 20.95,193.04 16.51,193.04 | 22.86,195.58 22.86,202.56 J.H1 | 45.09,196.22 45.09,202.56 J.R1 | 45.09,196.22 44.45,195.58 v34.29,195.58 22.86,195.58 | v52.07,194.94 52.07,202.56 J.T1 | v56.52,194.94 57.78,196.22 57.78,202.56 J.V1 | E1.47 73.66,82.55 | 73.66,82.55 C1.2 73.66,19.05 | 72.39,82.55 67.31,82.55 67.31,85.09 E1.42 | 72.39,82.55 73.66,82.55 | 72.39,82.55 72.39,87 73.66,88.27 v73.66,104.14 E1.82 72.39,113.03 C3.2 72.39,172.72 68.58,172.72 45.09,196.22 | v121.92,15.88 121.92,8.26 U$2.CC2 | C37.- 111.76,17.78 111.76,8.26 U$2.CF2 | v92.71,15.88 92.71,8.26 U$2.CN2 | 51.44,15.24 v46.99,15.24 43.18,15.24 42.55,14.61 42.55,8.26 U$2.DF2 | 51.44,15.24 51.44,8.26 U$2.DC2 | 73.66,19.05 51.44,19.05 51.44,15.24 | 73.66,19.05 75.56,19.05 80.01,14.61 80.01,8.26 U$2.CT2 | U$2.DT2 10.79,8.26 10.79,15.24 v11.43,15.88 15.24,19.68 22.86,19.68 22.86,8.26 U$2.DN2
  Bottom 0.61: 214,15.24 214,8.26 U$2.AT1 | 225.43,15.24 214,15.24 | 225.43,15.24 226.06,14.61 226.06,8.26 U$2.AN1 | 225.43,15.24 v226.06,15.88 245.75,15.88 | 245.75,15.88 245.75,21.59 255.27,21.59 | 245.75,15.88 245.75,8.26 U$2.AF1 | C35.- 255.27,21.59 | 255.27,21.59 255.27,8.26 U$2.AC2 | U$2.BT2 144.15,8.26 v144.15,15.88 144.78,16.51 154.31,16.51 | 155.57,15.24 156.21,14.61 156.21,8.26 U$2.BN2 | 155.57,15.24 154.31,16.51 | 155.57,15.24 v156.21,15.88 | 175.26,15.88 175.26,16.51 154.31,16.51 | 175.26,15.88 175.26,15.24 | 175.26,15.24 175.26,8.26 U$2.BF2 | 175.26,15.24 184.78,15.24 184.78,8.26 U$2.BC2 | v175.9,15.88 175.26,15.88 | 214,15.24 207.65,21.59 C36.- 111.76,21.59 | 96.52,195.58 96.52,202.56 H.J2 | 98.42,195.58 96.52,195.58 | 98.42,195.58 99.06,196.22 99.06,202.56 H.K2 | 102.23,195.58 102.23,202.56 H.L2 | 98.42,195.58 102.23,195.58 | 105.41,195.58 105.41,202.56 H.M2 | 102.23,195.58 105.41,195.58 | 108.58,195.58 108.58,202.56 H.N2 | 105.41,195.58 108.58,195.58 | 111.76,195.58 111.76,202.56 H.P2 | 108.58,195.58 111.76,195.58 | 114.94,195.58 114.94,202.56 H.R2 | 111.76,195.58 114.94,195.58 | 114.94,195.58 118.11,195.58 118.11,202.56 H.S2 | 15.88,195.58 10.79,195.58 10.79,202.56 J.C2 | 15.88,195.58 16.51,196.22 16.51,202.56 J.E1 | 22.86,195.58 22.86,202.56 J.H1 | 15.88,195.58 22.86,195.58 | 45.09,195.58 45.09,202.56 J.R1 | 22.86,195.58 v34.29,195.58 45.09,195.58 | 51.44,195.58 v52.07,194.94 53.34,194.94 | 45.09,195.58 51.44,195.58 | 51.44,195.58 51.44,202.56 J.T1 | 53.34,194.94 v56.52,194.94 | 96.52,195.58 91.44,190.5 57.78,190.5 53.34,194.94 | E1.19 v73.66,104.14 75.56,104.14 79.38,107.95 83.82,107.95 | C4.2 83.82,107.95
  Bottom 0.61: 83.82,107.95 E1.72 | E1.7 66.04,119.38 71.12,119.38 C3.2 | C2.2 49.53,86.36 E1.32 54.61,87.63 67.31,87.63 | 67.31,87.63 71.12,91.44 E1.59 | 67.31,87.63 E1.42 | U$2.CC2 121.92,8.26 v121.92,15.88 121.28,16.51 111.76,16.51 | 80.64,19.05 80.64,21.59 92.71,21.59 | 80.64,19.05 80.64,8.26 U$2.CT2 | 92.71,21.59 C37.- 111.76,21.59 | 92.71,21.59 v92.71,15.88 92.71,8.26 U$2.CN2 | 111.76,21.59 111.76,16.51 | 111.76,16.51 111.76,8.26 U$2.CF2 | 11.43,15.24 22.23,15.24 22.86,14.61 | 11.43,15.24 10.79,15.24 10.79,8.26 U$2.DT2 | 22.86,14.61 22.86,8.26 U$2.DN2 | 41.91,15.24 41.91,16.51 24.77,16.51 22.86,14.61 | 41.91,15.24 41.91,8.26 U$2.DF2 | 51.44,15.24 51.44,8.26 U$2.DC2 | 41.91,15.24 v46.99,15.24 51.44,15.24 | 11.43,15.24 v11.43,15.88 | 80.64,19.05 55.24,19.05 51.44,15.24
GTF+IND
  Top 0.61: J.S1 48.9,202.56 48.9,196.22 54.61,190.5 72.39,190.5 72.39,193.68 73.66,194.94 73.66,202.56 H.A1
INCR_SC  (via drill 0.81)
  Top 0.61: v97.16,104.14 99.06,106.05 99.06,202.56 H.K1
  Bottom 0.61: v97.16,104.14 E1.68
INIT  (via drill 0.81)
  Top 0.61: v77.47,104.14 76.2,102.87 76.2,88.27 74.93,87 74.93,24.77 84.45,15.24 86.36,15.24 86.36,8.26 U$2.CR1
  Bottom 0.61: v77.47,104.14 E1.69
INT_IN_PROG  (via drill 0.81)
  Top 0.61: v123.19,115.57 151.76,87 v151.76,15.24
  Bottom 0.61: E1.79 77.47,115.57 v123.19,115.57 | v151.76,15.24 152.4,15.24 153.03,14.61 153.03,8.26 U$2.BP2
LAST_STEP_L  (via drill 0.81)
  Top 0.61: v80.64,182.88 80.64,202.56 H.C1
  Bottom 0.61: E1.33 37.47,83.82 36.83,84.45 36.83,170.18 66.67,170.18 79.38,182.88 v80.64,182.88
MA_MS_LC  (via drill 0.81)
  Top 0.61: v128.27,114.3 161.29,81.28 v161.29,15.24
  Bottom 0.61: v128.27,114.3 E1.75 | v161.29,15.24 171.45,15.24 172.09,14.61 172.09,8.26 U$2.BH2
MD0  (via drill 0.81)
  Top 0.61: E1.76 82.55,110.49 90.17,110.49 v90.17,100.33 | v235.59,46.35 235.59,8.26 U$2.AK1
  Bottom 0.61: v90.17,100.33 90.81,100.97 180.97,100.97 v235.59,46.35
MD1  (via drill 0.81)
  Top 0.61: v150.5,116.84 164.47,130.81 232.41,130.81 232.41,8.26 U$2.AL1
  Bottom 0.61: E1.81 76.2,116.84 v150.5,116.84
MD2  (via drill 0.81)
  Top 0.61: v55.88,129.54 E1.11 | v165.1,129.54 229.24,65.41 229.24,8.26 U$2.AM1
  Bottom 0.61: v165.1,129.54 v55.88,129.54
MD3  (via drill 0.81)
  Top 0.61: E1.10 57.15,113.03 v57.15,128.27 | v163.83,128.27 222.88,69.22 222.88,8.26 U$2.AP1
  Bottom 0.61: v163.83,128.27 v57.15,128.27
MD4  (via drill 0.81)
  Top 0.61: v124.46,127 165.74,85.72 165.74,8.26 U$2.BK1
  Bottom 0.61: E1.12 53.34,127 v124.46,127
MD5  (via drill 0.81)
  Top 0.61: v58.42,124.46 E1.9 | v123.19,125.73 162.56,86.36 162.56,8.26 U$2.BL1
  Bottom 0.61: v58.42,124.46 59.69,125.73 v123.19,125.73
MD6  (via drill 0.81)
  Top 0.61: v76.2,107.95 E1.80 | v72.39,95.25 v72.39,105.41 | v159.38,57.15 159.38,8.26 U$2.BM1
  Bottom 0.61: v76.2,107.95 73.66,105.41 v72.39,105.41 | v72.39,95.25 121.28,95.25 v159.38,57.15
MD7  (via drill 0.81)
  Top 0.61: v137.79,102.87 153.03,87.63 153.03,8.26 U$2.BP1
  Bottom 0.61: E1.67 82.55,102.87 v137.79,102.87
MD8  (via drill 0.81)
  Top 0.61: E1.65 82.55,97.79 85.09,97.79 v85.09,47.62 | v36.83,19.68 33.02,15.88 33.02,8.26 U$2.DK1
  Bottom 0.61: v85.09,47.62 83.82,46.35 76.83,46.35 50.16,19.68 v36.83,19.68
MD9  (via drill 0.81)
  Top 0.61: v64.77,100.33 62.23,97.79 62.23,81.92 40.64,60.33 v40.64,30.48 | v29.84,24.77 29.84,8.26 U$2.DL1
  Bottom 0.61: E1.64 82.55,100.33 v64.77,100.33 | v40.64,30.48 34.92,24.77 v29.84,24.77
MD10  (via drill 0.81)
  Top 0.61: E1.63 82.55,95.25 v82.55,50.16 | v29.84,33.02 26.67,29.84 26.67,8.26 U$2.DM1
  Bottom 0.61: v82.55,50.16 81.28,51.44 48.26,51.44 v29.84,33.02
MD11  (via drill 0.81)
  Top 0.61: v19.05,16.51 19.68,15.88 19.68,8.26 U$2.DP1
  Bottom 0.61: E1.37 13.97,36.83 13.97,16.51 v19.05,16.51
MODEB  (via drill 0.81)
  Top 0.61: v74.93,93.98 74.93,180.97 73.66,182.25 v73.66,189.23 73.66,193.04 74.93,194.31 v74.93,194.94 | v114.94,194.31 114.94,202.56 H.R1
  Bottom 0.61: E1.31 60.96,93.98 v74.93,93.98 | v74.93,194.94 73.66,196.22 73.66,202.56 H.A2 | v114.94,194.31 109.86,189.23 v73.66,189.23
NEXT_LOC  (via drill 0.81)
  Top 0.61: E1.44 66.04,88.9 66.04,107.31 62.23,111.12 v62.23,135.89 | v110.49,184.15 111.76,185.42 111.76,202.56 H.P1
  Bottom 0.61: v110.49,184.15 v62.23,135.89
RESTART
  Bottom 0.61: J.V2 58.42,202.56 58.42,191.77 89.53,191.77 92.71,194.94 92.71,202.56 H.H2
ROM_11_L  (via drill 0.81)
  Top 0.61: E1.28 49.53,95.25 v49.53,171.45 | v81.92,184.15 83.82,186.06 v83.82,193.04
  Bottom 0.61: v49.53,171.45 62.23,184.15 v81.92,184.15 | v83.82,193.04 83.82,202.56 H.D2
ROM_12_L  (via drill 0.81)
  Top 0.61: E1.4 64.77,113.03 64.77,174.62 v51.44,187.96 | v76.83,194.31 76.2,193.68 R4.1
  Bottom 0.61: R4.1 v51.44,187.96 | v76.83,194.31 76.83,202.56 H.B2
ROM_13_L  (via drill 0.81)
  Top 0.61: v97.16,97.79 101.6,102.23 101.6,195.58 102.23,196.22 102.23,202.56 H.L1
  Bottom 0.61: E1.25 57.15,97.79 v97.16,97.79
ROM_14_L  (via drill 0.81)
  Top 0.61: v80.01,102.87 80.01,160.02 78.11,161.93 78.11,195.58 77.47,196.22 77.47,202.56 H.B1
  Bottom 0.61: E1.27 54.61,95.25 54.61,102.87 v80.01,102.87
ROM_15_L  (via drill 0.81)
  Top 0.61: E1.24 50.8,99.06 v50.8,136.53 | v87.63,194.94 v87.63,173.35
  Bottom 0.61: v87.63,173.35 v50.8,136.53 | v87.63,194.94 86.36,196.22 86.36,202.56 H.E2
ROM_17_L  (via drill 0.81)
  Top 0.61: E1.16 52.07,107.95 52.07,135.89 v63.5,147.32 | v79.38,194.94 v79.38,163.19
  Bottom 0.61: v79.38,163.19 v63.5,147.32 | v79.38,194.94 80.64,196.22 80.64,202.56 H.C2
ROM_22_L  (via drill 0.81)
  Top 0.61: v95.25,91.44 95.89,92.08 95.89,202.56 H.J1
  Bottom 0.61: v95.25,91.44 E1.58
ROM_24_L  (via drill 0.81)
  Top 0.61: v97.16,93.98 102.87,99.69 102.87,193.68 105.41,196.22 105.41,202.56 H.M1
  Bottom 0.61: v97.16,93.98 E1.60
RTF  (via drill 0.81)
  Top 0.61: v13.97,194.31 13.97,202.56 J.D1 | v121.28,194.31 121.28,202.56 H.T1
  Bottom 0.61: v13.97,194.31 22.86,185.42 112.39,185.42 v121.28,194.31
TCK
  Bottom 0.61: E1.62 177.16,96.52 SV1.1
TDI
  Bottom 0.61: E1.14 54.61,110.49 54.61,123.19 167,123.19 SV1.9
TDO
  Bottom 0.61: E1.71 82.55,105.41 175.26,105.41 177.16,103.5 179.07,103.5 SV1.3
TMS  (via drill 0.81)
  Top 0.61: E1.23 59.69,102.87 v59.69,116.2
  Bottom 0.61: v59.69,116.2 65.41,121.92 88.9,121.92 91.44,119.38 163.83,119.38 177.16,106.05 179.07,106.05 SV1.5
TP1  (via drill 0.81)
  Top 0.61: v105.41,113.03 105.41,50.16 116.84,38.73 v116.84,15.24
  Bottom 0.61: E1.77 80.01,113.03 v105.41,113.03 | v116.84,15.24 117.47,15.24 118.11,14.61 118.11,8.26 U$2.CD2
TP2  (via drill 0.81)
  Top 0.61: v111.76,22.86 113.67,20.95 v113.67,15.24
  Bottom 0.61: E1.39 63.5,53.98 80.64,53.98 v111.76,22.86 | v113.67,15.24 114.3,15.24 114.94,14.61 114.94,8.26 U$2.CE2
TP2_D  (via drill 0.81)
  Top 0.61: v71.12,160.66 E1.83 | v90.81,194.94 v90.81,180.34
  Bottom 0.61: v90.81,180.34 v71.12,160.66 | v90.81,194.94 89.53,196.22 89.53,202.56 H.F2
TP3  (via drill 0.81)
  Top 0.61: v89.53,118.11 93.98,113.67 93.98,29.21 v107.31,15.88
  Bottom 0.61: E1.1 72.39,118.11 v89.53,118.11 | v107.31,15.88 108.58,14.61 108.58,8.26 U$2.CH2
TP4  (via drill 0.81)
  Top 0.61: E1.74 91.44,111.76 91.44,97.79 92.71,96.52 92.71,27.3 v104.14,15.88
  Bottom 0.61: v104.14,15.88 105.41,14.61 105.41,8.26 U$2.CJ2
TS3  (via drill 0.81)
  Top 0.61: E1.70 87.63,102.87 87.63,99.69 91.44,95.89 91.44,19.05 v94.61,15.88
  Bottom 0.61: v94.61,15.88 95.89,14.61 95.89,8.26 U$2.CM2
VCC  (via drill 0.81)
  Top 0.61: R11.2 69.85,135.89 v69.85,171.45 | v106.68,43.18 VCCINT.1 VCCIO.1 v104.14,130.81 | SV1.4 179.07,100.97 179.07,52.7 183.51,48.26 183.51,43.81 | C36.+ 183.51,43.81 | 183.51,43.81 v183.51,20.32
  Bottom 0.61: 183.51,19.05 186.69,19.05 191.13,14.61 191.13,8.26 U$2.BA2 | 183.51,19.05 128.27,19.05 128.27,8.26 U$2.CA2 | v69.85,171.45 R4.2 R3.2 | U$2.AA2 260.99,8.26 260.99,21.59 259.08,23.5 C35.+ C36.+ C37.+ v106.68,43.18 | R11.2 72.39,130.81 v104.14,130.81 | v183.51,20.32 183.51,19.05
VCCINT  (via drill 0.81)
  Top 0.61: E1.3 C3.1 67.31,121.92 67.31,125.09 67.94,125.73 69.85,125.73 69.85,85.09 E1.43 | v100.33,45.72 VCCINT.2
  Bottom 0.61: v100.33,45.72 C1.1 68.58,78.74 E1.43
VCCIO  (via drill 0.81)
  Top 0.61: VCCIO.2 100.33,48.26 v100.33,80.01 | E1.38 57.15,90.17 54.61,90.17 | 54.61,90.17 48.26,90.17 C2.1 | E1.13 54.61,110.49 54.61,90.17 | E1.66 82.55,100.33 80.01,100.33 | 80.01,100.33 78.74,100.33 E1.78 | E1.53 80.01,85.09 80.01,100.33
  Bottom 0.61: v100.33,80.01 96.52,83.82 E1.53 | C4.1 E1.66 | E1.26 C2.1 | E1.78 77.47,113.03 57.15,113.03 E1.13

### Text on the board
Top: FLIP CHIP | SIDE 1 | CS*ABCDEFHJKLMNPRSTUVWXYZ | + | +
Bottom: M8340X | SIDE 2 | DECODER AND STEP COUNTER